# Altium schematic sheet tie-il0r.SchDoc: Net Tie IL0R
size Letter; CheckedBy: J. Brinton; CompanyName: Signal Laboratories, Inc.; DrawnBy: J. Brinton; Engineer: J. Brinton; Address1: 3479 Edison Way; Address2: Menlo Park CA 94025; Address3: +1 (877) 778-8435; Address4: siglabs.com; Revision: 3; SheetNumber: 42; SheetTotal: 45
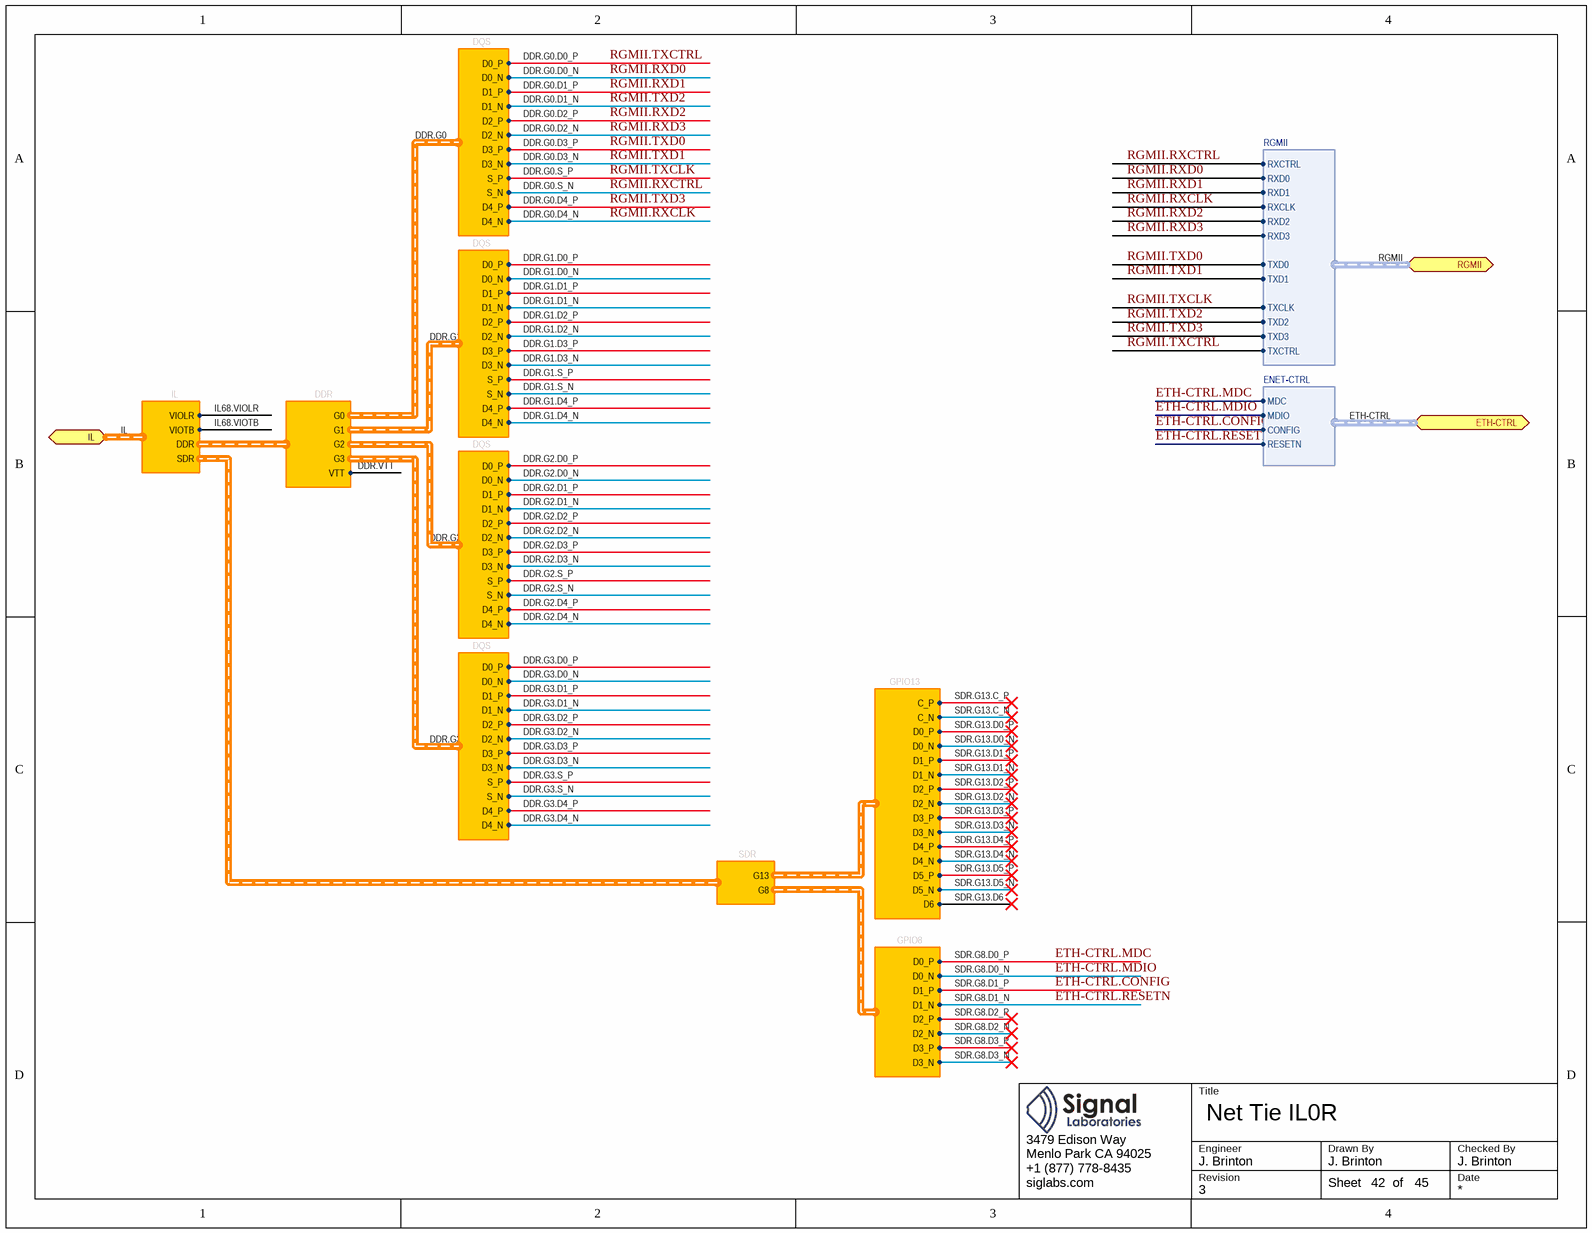
[diagram p0: tie-il0r.SchDoc]

## Ports
ETH-CTRL (harness ENET-CTRL), IL (harness IL), RGMII (harness RGMII)

## Harnesses
DQS: D0_P, D0_N, D1_P, D1_N, D2_P, D2_N, D3_P, D3_N, D4_P, D4_N, S_P, S_N
DDR: G0, G1, G2, G3, VTT
GPIO8: D0_P, D0_N, D1_P, D1_N, D2_P, D2_N, D3_P, D3_N
SDR: G13, G8
GPIO13: C_P, C_N, D0_P, D0_N, D1_P, D1_N, D2_P, D2_N, D3_P, D3_N, D4_P, D4_N, D5_P, D5_N, D6
IL: DDR, SDR, VIOLR, VIOTB
RGMII: RXCTRL, RXD0, RXD1, RXD2, RXD3, RXCLK, TXCTRL, TXD0, TXD1, TXD2, TXD3, TXCLK
ENET-CTRL: RESETN, CONFIG, MDC, MDIO

## Nets
DDR.G0.D0_N: harness DQS.D0_N, port RGMII.RXD0  [also labelled RGMII.RXD0]
DDR.G0.D0_P: harness DQS.D0_P, port RGMII.TXCTRL  [also labelled RGMII.TXCTRL]
DDR.G0.D1_N: harness DQS.D1_N, port RGMII.TXD2  [also labelled RGMII.TXD2]
DDR.G0.D1_P: harness DQS.D1_P, port RGMII.RXD1  [also labelled RGMII.RXD1]
DDR.G0.D2_N: harness DQS.D2_N, port RGMII.RXD3  [also labelled RGMII.RXD3]
DDR.G0.D2_P: harness DQS.D2_P, port RGMII.RXD2  [also labelled RGMII.RXD2]
DDR.G0.D3_N: harness DQS.D3_N, port RGMII.TXD1  [also labelled RGMII.TXD1]
DDR.G0.D3_P: harness DQS.D3_P, port RGMII.TXD0  [also labelled RGMII.TXD0]
DDR.G0.D4_N: harness DQS.D4_N, port RGMII.RXCLK  [also labelled RGMII.RXCLK]
DDR.G0.D4_P: harness DQS.D4_P, port RGMII.TXD3  [also labelled RGMII.TXD3]
DDR.G0.S_N: harness DQS.S_N, port RGMII.RXCTRL  [also labelled RGMII.RXCTRL]
DDR.G0.S_P: harness DQS.S_P, port RGMII.TXCLK  [also labelled RGMII.TXCLK]
DDR.G1.D0_N: harness DQS.D0_N
DDR.G1.D0_P: harness DQS.D0_P
DDR.G1.D1_N: harness DQS.D1_N
DDR.G1.D1_P: harness DQS.D1_P
DDR.G1.D2_N: harness DQS.D2_N
DDR.G1.D2_P: harness DQS.D2_P
DDR.G1.D3_N: harness DQS.D3_N
DDR.G1.D3_P: harness DQS.D3_P
DDR.G1.D4_N: harness DQS.D4_N
DDR.G1.D4_P: harness DQS.D4_P
DDR.G1.S_N: harness DQS.S_N
DDR.G1.S_P: harness DQS.S_P
DDR.G2.D0_N: harness DQS.D0_N
DDR.G2.D0_P: harness DQS.D0_P
DDR.G2.D1_N: harness DQS.D1_N
DDR.G2.D1_P: harness DQS.D1_P
DDR.G2.D2_N: harness DQS.D2_N
DDR.G2.D2_P: harness DQS.D2_P
DDR.G2.D3_N: harness DQS.D3_N
DDR.G2.D3_P: harness DQS.D3_P
DDR.G2.D4_N: harness DQS.D4_N
DDR.G2.D4_P: harness DQS.D4_P
DDR.G2.S_N: harness DQS.S_N
DDR.G2.S_P: harness DQS.S_P
DDR.G3.D0_N: harness DQS.D0_N
DDR.G3.D0_P: harness DQS.D0_P
DDR.G3.D1_N: harness DQS.D1_N
DDR.G3.D1_P: harness DQS.D1_P
DDR.G3.D2_N: harness DQS.D2_N
DDR.G3.D2_P: harness DQS.D2_P
DDR.G3.D3_N: harness DQS.D3_N
DDR.G3.D3_P: harness DQS.D3_P
DDR.G3.D4_N: harness DQS.D4_N
DDR.G3.D4_P: harness DQS.D4_P
DDR.G3.S_N: harness DQS.S_N
DDR.G3.S_P: harness DQS.S_P
DDR.VTT: harness DDR.VTT
ETH-CTRL.CONFIG: harness GPIO8.D1_P, port ETH-CTRL.CONFIG  [also labelled SDR.G8.D1_P]
ETH-CTRL.MDC: harness GPIO8.D0_P, port ETH-CTRL.MDC  [also labelled SDR.G8.D0_P]
ETH-CTRL.MDIO: harness GPIO8.D0_N, port ETH-CTRL.MDIO  [also labelled SDR.G8.D0_N]
ETH-CTRL.RESETN: harness GPIO8.D1_N, port ETH-CTRL.RESETN  [also labelled SDR.G8.D1_N]
IL68.VIOLR: port IL.VIOLR  [project net IL.VIOLR]
IL68.VIOTB: port IL.VIOTB  [project net IL.VIOTB]
SDR.G8.D2_N: harness GPIO8.D2_N
SDR.G8.D2_P: harness GPIO8.D2_P
SDR.G8.D3_N: harness GPIO8.D3_N
SDR.G8.D3_P: harness GPIO8.D3_P
SDR.G13.C_N: harness GPIO13.C_N
SDR.G13.C_P: harness GPIO13.C_P
SDR.G13.D0_N: harness GPIO13.D0_N
SDR.G13.D0_P: harness GPIO13.D0_P
SDR.G13.D1_N: harness GPIO13.D1_N
SDR.G13.D1_P: harness GPIO13.D1_P
SDR.G13.D2_N: harness GPIO13.D2_N
SDR.G13.D2_P: harness GPIO13.D2_P
SDR.G13.D3_N: harness GPIO13.D3_N
SDR.G13.D3_P: harness GPIO13.D3_P
SDR.G13.D4_N: harness GPIO13.D4_N
SDR.G13.D4_P: harness GPIO13.D4_P
SDR.G13.D5_N: harness GPIO13.D5_N
SDR.G13.D5_P: harness GPIO13.D5_P
SDR.G13.D6: harness GPIO13.D6

## Buses and harness runs
harness ETH-CTRL = port ETH-CTRL
harness IL = port IL
harness RGMII = port RGMII

## Notes on the sheet
- Title
- Engineer
- Revision
- Drawn By
- Checked By
- Date
- Sheet
- of